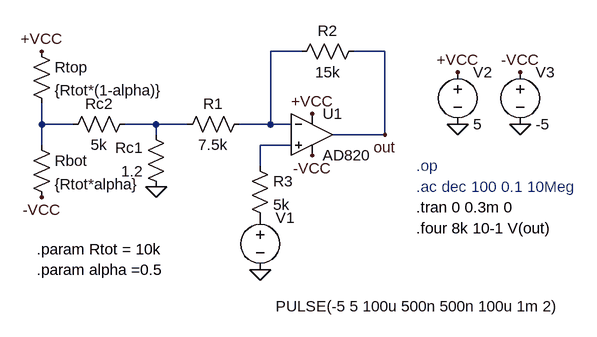
[diagram p0: schematic Etaj1SR.asc]
Etaj1SR.asc, the LTspice schematic file:
Version 4.1
SHEET 1 880 680
WIRE 256 16 208 16
WIRE 384 16 336 16
WIRE -144 128 -144 96
WIRE -96 128 -144 128
WIRE 32 128 -16 128
WIRE 80 128 32 128
WIRE 208 128 208 16
WIRE 208 128 160 128
WIRE 240 128 208 128
WIRE 32 144 32 128
WIRE 384 144 384 16
WIRE 384 144 304 144
WIRE -144 160 -144 128
WIRE 240 160 192 160
WIRE 192 192 192 160
FLAG 32 224 0
FLAG 496 128 0
FLAG 592 128 0
FLAG 192 352 0
FLAG 496 48 +VCC
FLAG 272 112 +VCC
FLAG -144 16 +VCC
FLAG 592 48 -VCC
FLAG 272 176 -VCC
FLAG -144 240 -VCC
FLAG 384 144 out
SYMBOL OpAmps\\AD820 272 80 R0
SYMATTR InstName U1
SYMBOL res 176 112 R90
WINDOW 0 0 56 VBottom 2
WINDOW 3 32 56 VTop 2
SYMATTR InstName R1
SYMATTR Value 7.5k
SYMBOL res 48 240 R180
WINDOW 0 36 76 Left 2
WINDOW 3 36 40 Left 2
SYMATTR InstName Rc1
SYMATTR Value 1.2
SYMBOL res -112 144 R270
WINDOW 0 32 56 VTop 2
WINDOW 3 0 56 VBottom 2
SYMATTR InstName Rc2
SYMATTR Value 5k
SYMBOL res -160 0 R0
SYMATTR InstName Rtop
SYMATTR Value {Rtot*(1-alpha)}
SYMBOL res -160 144 R0
SYMATTR InstName Rbot
SYMATTR Value {Rtot*alpha}
SYMBOL res 176 176 R0
SYMATTR InstName R3
SYMATTR Value 5k
SYMBOL res 352 0 R90
WINDOW 0 0 56 VBottom 2
WINDOW 3 32 56 VTop 2
SYMATTR InstName R2
SYMATTR Value 15k
SYMBOL voltage 192 256 R0
WINDOW 3 24 152 Left 2
WINDOW 123 24 124 Left 2
WINDOW 39 0 0 Left 0
SYMATTR Value PULSE(-5 5 100u 500n 500n 100u 1m 2)
SYMATTR InstName V1
SYMBOL voltage 496 32 R0
SYMATTR InstName V2
SYMATTR Value 5
SYMBOL voltage 592 32 R0
SYMATTR InstName V3
SYMATTR Value -5
TEXT -152 320 Left 2 !.param Rtot = 10k
TEXT -152 352 Left 2 !.param alpha =0.5
TEXT 432 192 Left 2 ;.op
TEXT 432 224 Left 2 ;.ac dec 100 0.1 10Meg
TEXT 432 256 Left 2 !.tran 0 0.3m 0
TEXT 432 288 Left 2 !.four 8k 10-1 V(out)

The netlist it stands for:
* Etaj1SR.asc
X§U1 N004 N001 +VCC -VCC out AD820  ; pins In+ In- V+ V- OUT
R1 N001 N003 7.5k
Rc1 0 N003 1.2
Rc2 N002 N003 5k
Rtop +VCC N002 {Rtot*(1-alpha)}
Rbot N002 -VCC {Rtot*alpha}
R3 N004 P001 5k
R2 out N001 15k
V1 P001 0 PULSE(-5 5 100u 500n 500n 100u 1m 2)
V2 +VCC 0 5
V3 -VCC 0 -5
.param Rtot = 10k
.param alpha =0.5
* .op
* .ac dec 100 0.1 10Meg
.tran 0 0.3m 0
.four 8k 10-1 V(out)
.backanno
.end